# EAGLE schematic Tds_NonSmd (EAGLE 9.2.0)
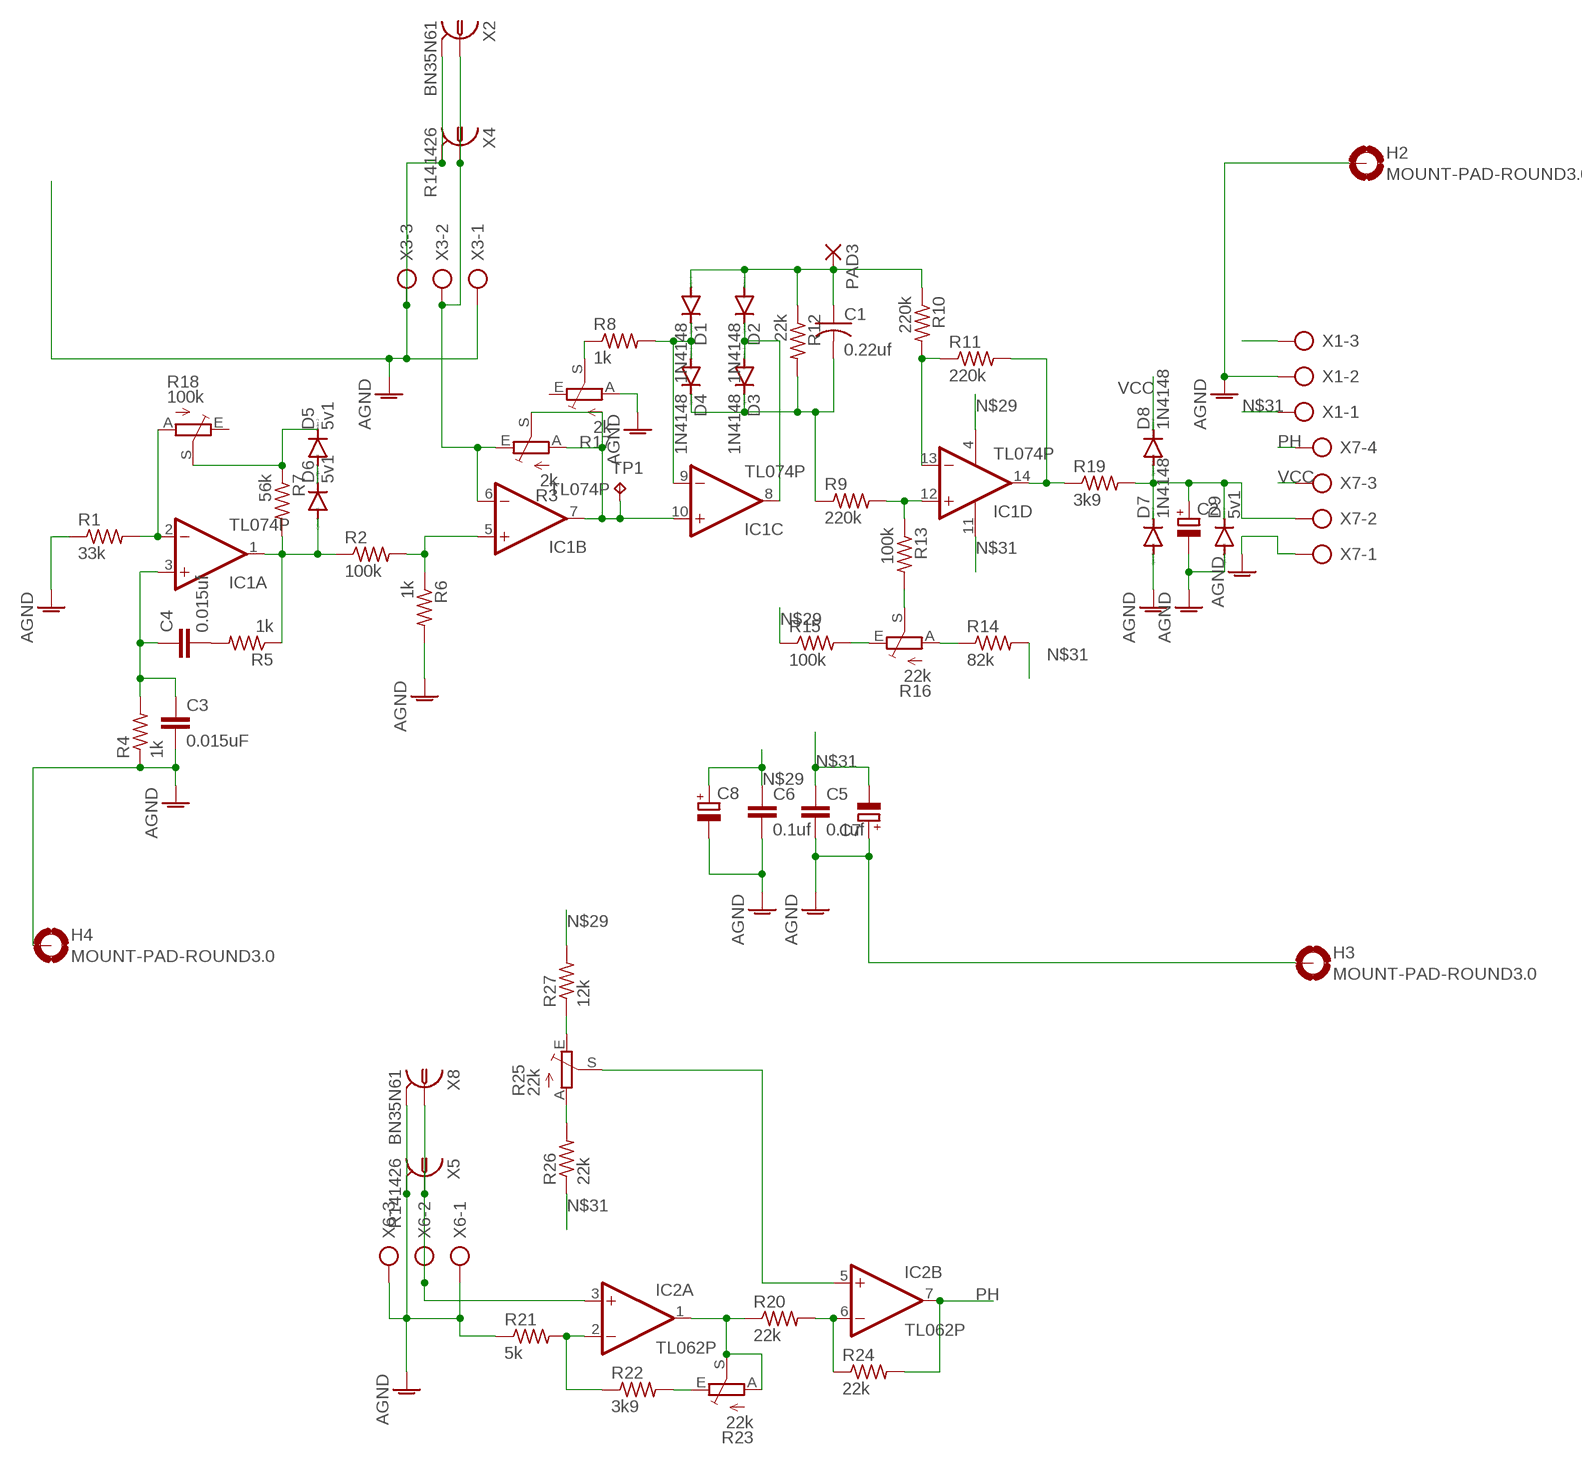
[diagram p0: schematic, sheet 1]

## Parts
C1  0.22uf  C-US050-024X044  [C050-024X044]
C2  CPOL-EUE5-8.5  [E5-8,5]
C3  0.015uF  C-EU050-024X044  [C050-024X044]
C4  0.015uf  C-EU050-024X044  [C050-024X044]
C5  0.1uf  C5/2.5  [C5B2.5]
C6  0.1uf  C5/2.5  [C5B2.5]
C7  CPOL-EUE5-8.5  [E5-8,5]
C8  CPOL-EUE5-8.5  [E5-8,5]
D1  1N4148  1N4148DO35-7  [DO35-7]
D2  1N4148  1N4148DO35-7  [DO35-7]
D3  1N4148  1N4148DO35-7  [DO35-7]
D4  1N4148  1N4148DO35-7  [DO35-7]
D5  5v1  1N4148DO35-7  [DO35-7]
D6  5v1  1N4148DO35-7  [DO35-7]
D7  1N4148  1N4148DO35-7  [DO35-7]
D8  1N4148  1N4148DO35-7  [DO35-7]
D9  5v1  1N4148DO35-7  [DO35-7]
H2  MOUNT-PAD-ROUND3.0  [3,0-PAD]
H3  MOUNT-PAD-ROUND3.0  [3,0-PAD]
H4  MOUNT-PAD-ROUND3.0  [3,0-PAD]
IC1  TL074P  [DIL14]
IC2  TL062P  [DIL08]
PAD3  2,54/1,1  [2,54/1,1]
R1  33k  R-US_0207/7  [0207/7]
R2  100k  R-US_0207/10  [0207/10]
R3  2k  TRIM_EU-S64W  [S64W]
R4  1k  R-US_0207/7  [0207/7]
R5  1k  R-US_0207/7  [0207/7]
R6  1k  R-US_0207/7  [0207/7]
R7  56k  R-US_0207/7  [0207/7]
R8  1k  R-US_0207/7  [0207/7]
R9  220k  R-US_0207/7  [0207/7]
R10  220k  R-US_0207/7  [0207/7]
R11  220k  R-US_0207/7  [0207/7]
R12  22k  R-US_0207/7  [0207/7]
R13  100k  R-US_0207/7  [0207/7]
R14  82k  R-US_0207/7  [0207/7]
R15  100k  R-US_0207/7  [0207/7]
R16  22k  TRIM_EU-S64W  [S64W]
R17  2k  TRIM_EU-S64W  [S64W]
R18  100k  TRIM_EU-S64W  [S64W]
R19  3k9  R-US_0207/7  [0207/7]
R20  22k  R-US_0207/7  [0207/7]
R21  5k  R-US_0207/7  [0207/7]
R22  3k9  R-US_0207/7  [0207/7]
R23  22k  TRIM_EU-S64W  [S64W]
R24  22k  R-US_0207/7  [0207/7]
R25  22k  TRIM_EU-S64W  [S64W]
R26  22k  R-US_0207/7  [0207/7]
R27  12k  R-US_0207/7  [0207/7]
TP1  TPPAD1-13  [P1-13]
X1  AK500/3  [AK500/3]
X2  BN35N61  [B35N61]
X3  AK500/3  [AK500/3]
X4  R141426  [R141426]
X5  R141426  [R141426]
X6  AK500/3  [AK500/3]
X7  AK500/4  [AK500/4]
X8  BN35N61  [B35N61]

## Nets
AGND: C2.- C3.2 C5.2 C6.2 C7.+ C8.- D7.A D9.A H2.B3,0(MOUNT) H3.B3,0(MOUNT) H4.B3,0(MOUNT) R1.1 R4.1 R6.2 R17.A R21.1 X1.2 X2.2 X2.3 X2.4 X2.5 X3.1 X3.3 X4.2 X4.3 X4.4 X4.5 X5.2 X5.3 X5.4 X5.5 X6.1 X6.3 X7.1 X8.2 X8.3 X8.4 X8.5
N$1: IC1.2(A:-IN) R1.2 R18.A
N$2: IC1.6(B:-IN) R3.E X2.1 X3.2 X4.1
N$3: IC1.5(B:+IN) R2.2 R6.1
N$4: D6.A IC1.1(A:OUT) R2.1 R5.1 R7.2
N$5: C3.1 C4.1 IC1.3(A:+IN) R4.2
N$6: IC2.3(A:+IN) X5.1 X6.2 X8.1
N$7: IC1.7(B:OUT) IC1.10(C:+IN) R3.A R3.S TP1.TP
N$8: C4.2 R5.2
N$9: IC1.14(D:OUT) R11.2 R19.1
N$10: C1.1 D1.A D2.A PAD3.1(P) R10.1 R12.1
N$11: D1.C D4.A IC1.9(C:-IN) R8.2
N$12: D2.C D3.A IC1.8(C:OUT)
N$13: IC1.13(D:-IN) R10.2 R11.1
N$14: IC1.12(D:+IN) R9.2 R13.1
N$15: D5.C R7.1 R18.S
N$16: C1.2 D3.C D4.C R9.1 R12.2
N$17: D5.A D6.C
N$18: R13.2 R16.S
N$19: R14.1 R16.A
N$20: R15.2 R16.E
N$21: R8.1 R17.S
N$22: C2.+ D7.C D8.A D9.C R19.2 X7.2
N$23: R25.E R27.1
N$24: IC2.2(A:-IN) R21.2 R22.1
N$25: R25.A R26.2
N$26: IC2.1(A:OUT) R20.1 R23.A R23.S
N$27: R22.2 R23.E
N$28: IC2.6(B:-IN) R20.2 R24.1
N$29: C6.1 C8.+ IC1.4(P:V+) R15.1 R27.2 X1.3
N$30: IC2.5(B:+IN) R25.S
N$31: C5.1 C7.- IC1.11(P:V-) R14.2 R26.1 X1.1
PH: IC2.7(B:OUT) R24.2 X7.4
VCC: D8.C X7.3
Unconnected: R17.E R18.E

## Power pins joined to a net without a drawn wire
V+: IC2.8(P:V+)
V-: IC2.4(P:V-)

## Library data of the parts
C1 = rcl:C-US: CAPACITOR, American symbol; SPICEPREFIX: C
C2 C7 C8 = rcl:CPOL-EU: POLARIZED CAPACITOR, European symbol; SPICEPREFIX: C
C3 C4 = rcl:C-EU: CAPACITOR, European symbol; SPICEPREFIX: C
C5 C6 = capacitor-wima:C: CAPACITOR naming: grid - package width
D1-D9 = diode:1N4148: DIODE high speed (Philips)
H2-H4 = holes:MOUNT-PAD-ROUND: MOUNTING PAD, round
IC1 = linear:TL074: OP AMP
IC2 = linear:TL062: OP AMP
PAD3 = wirepad:2,54/1,1: THROUGH-HOLE PAD
R1 R4-R15 R19-R22 R24 R26 R27 = resistor:R-US_: RESISTOR, American symbol
R2 = rcl:R-US_: RESISTOR, American symbol; SPICEPREFIX: R
R3 R16-R18 R23 R25 = pot:TRIM_EU-: POTENTIOMETER
TP1 = testpad:TP: Test pad
X1 X3 X6 = con-ptr500:AK500/3: CONNECTOR; OC_FARNELL: unknown; OC_NEWARK: unknown
X2 X8 = con-coax:BN35N61: BNC CONNECTOR M/A COM www.macom.com distributor Farnell 149-452; OC_FARNELL: unknown; OC_NEWARK: unknown
X4 X5 = con-coax:R141426: BNC COAX CONNECTOR Radiall 50/75 Ohm Spoerle; MF: FARNELL; MPN: R141426161; OC_FARNELL: 4195115; OC_NEWARK: 14J7919
X7 = con-ptr500:AK500/4: CONNECTOR; OC_FARNELL: unknown; OC_NEWARK: unknown